# Altium schematic sheet sumboost.SchDoc
size A2
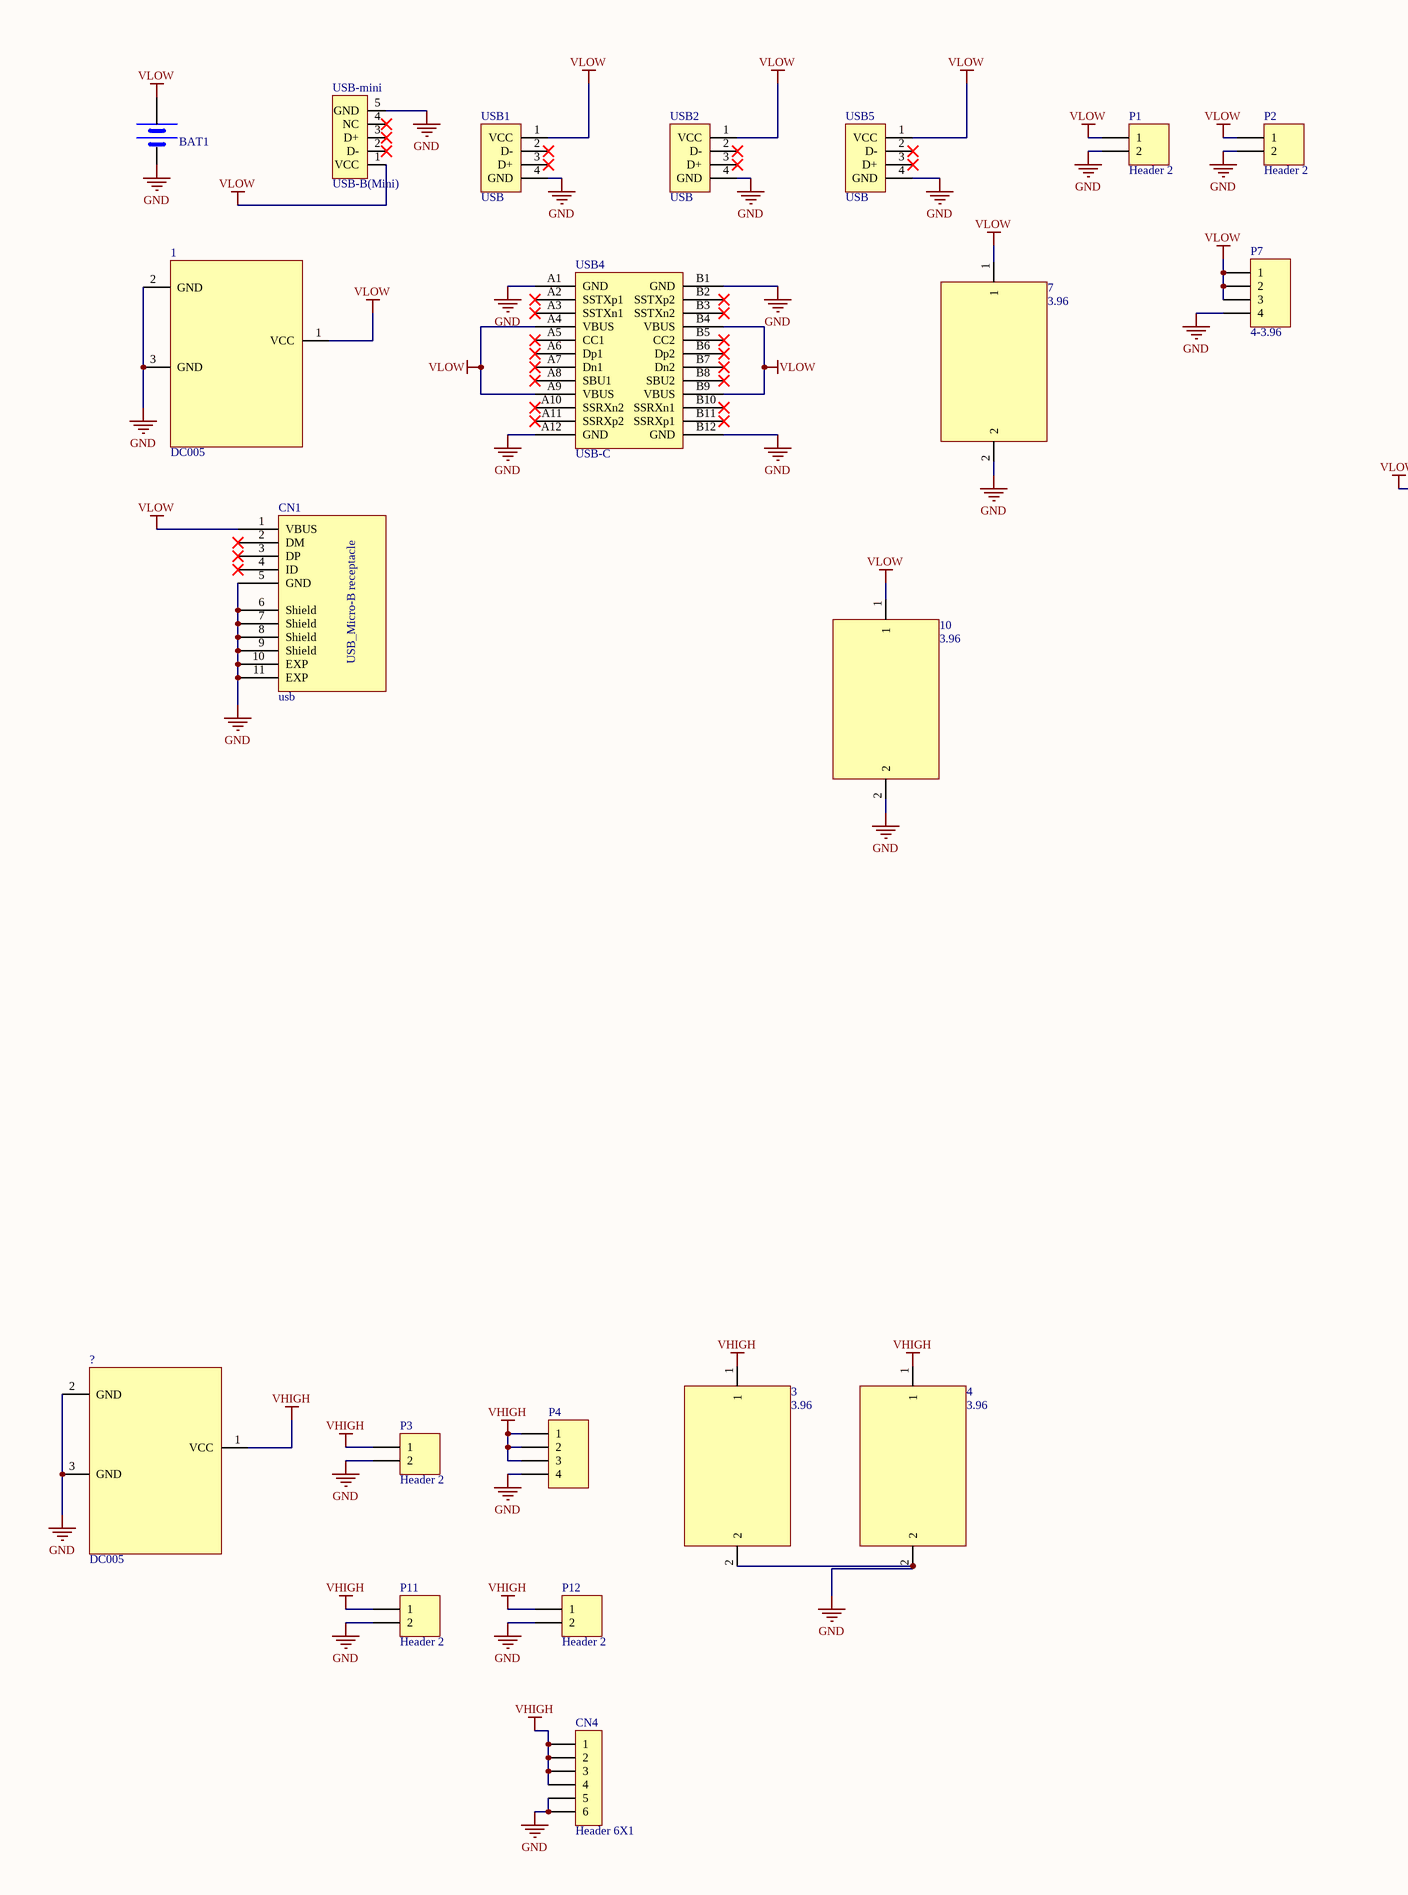
[diagram p0: sumboost.SchDoc, left]
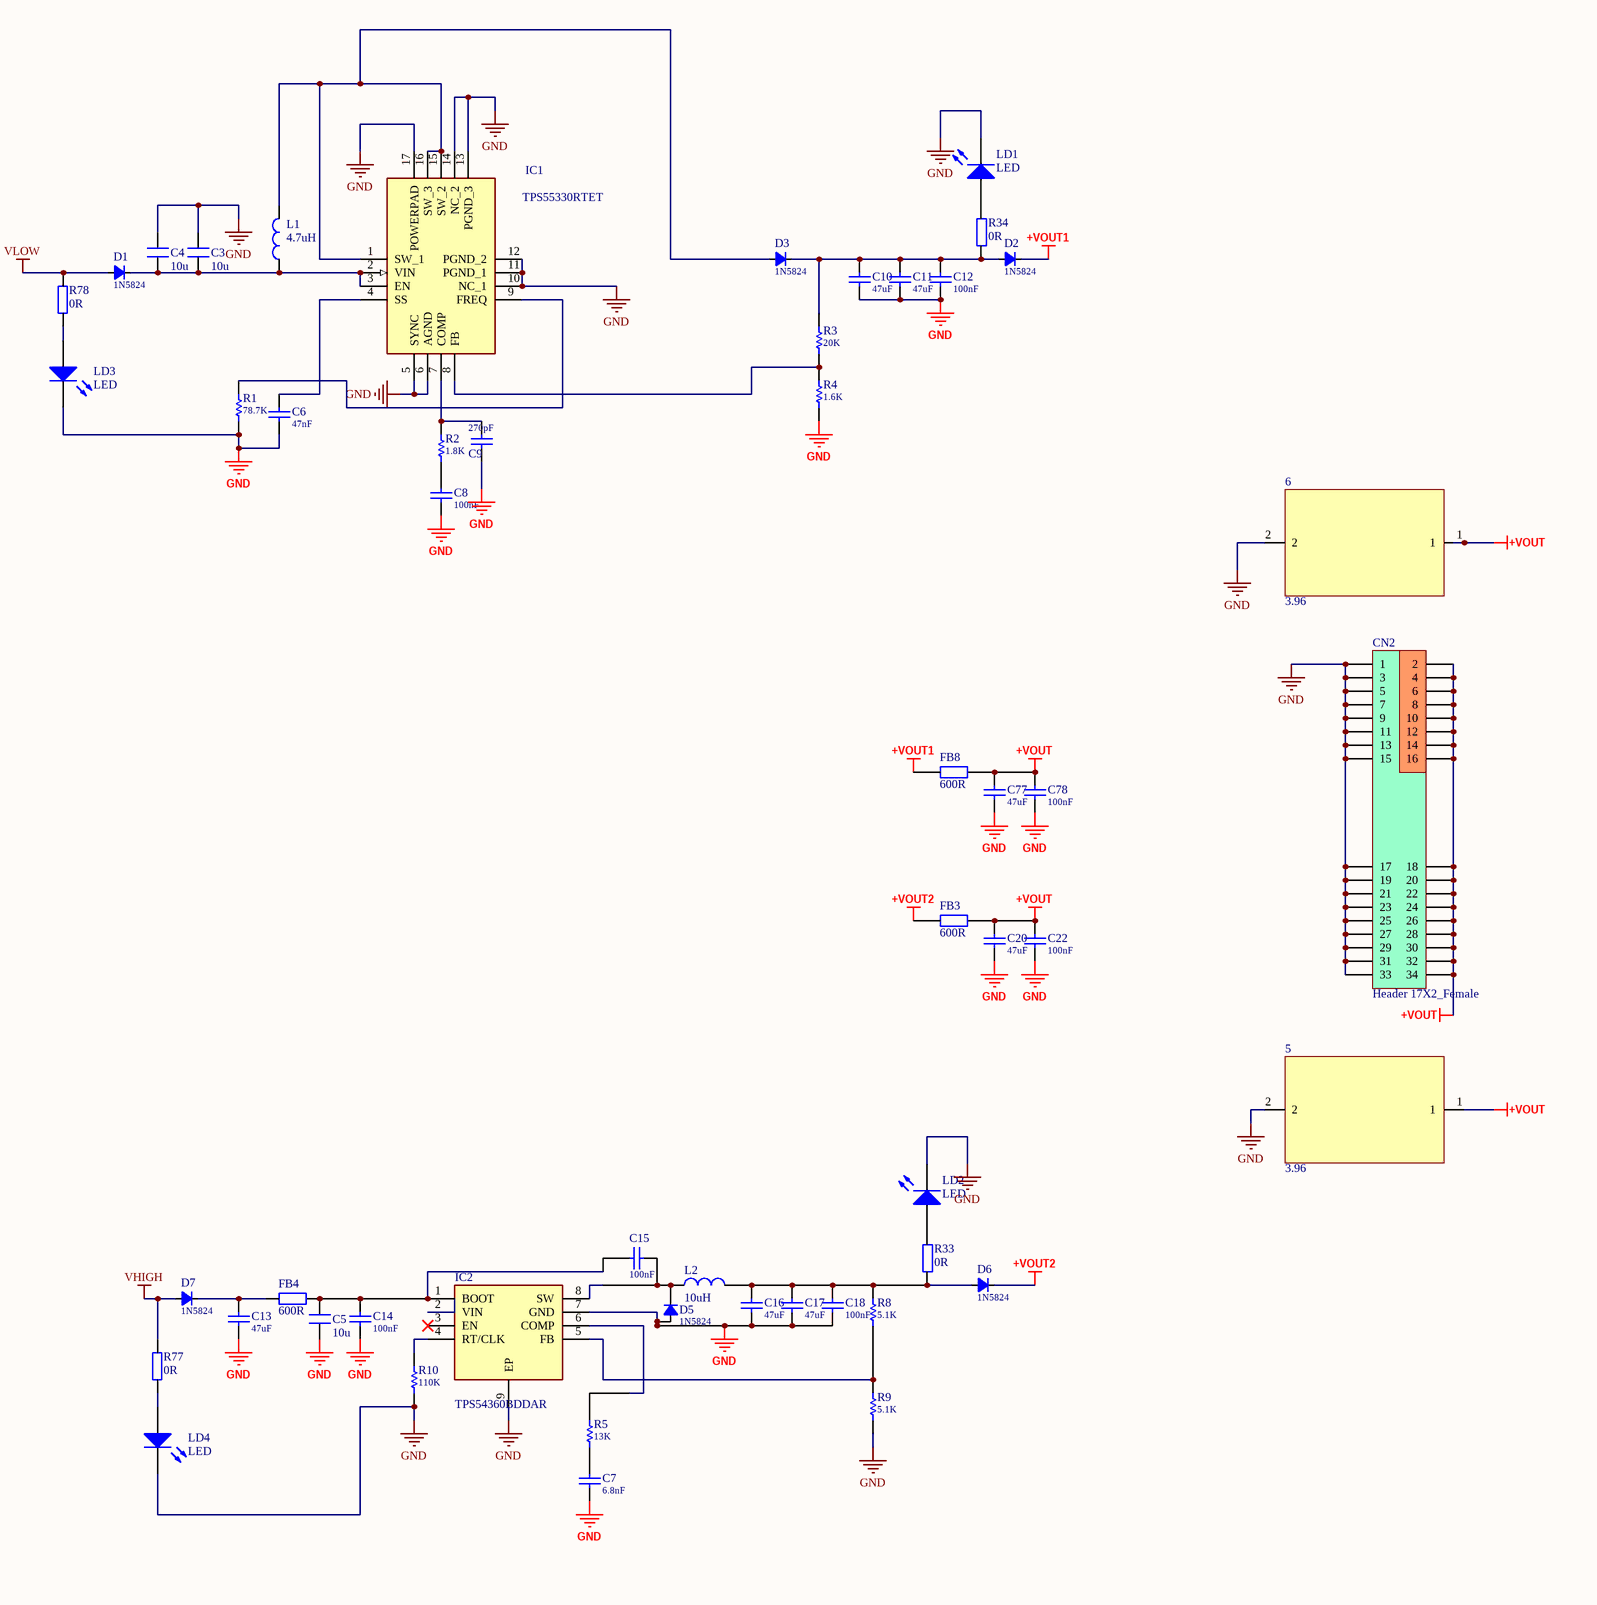
[diagram p1: sumboost.SchDoc, right]

## Parts
1  DC005  [DC10B]
3  3.96  [3.96]
4  3.96  [3.96]
5  3.96  [3.96]
6  3.96  [3.96]
7  3.96  [3.96]
10  3.96  [3.96]
?  DC005  [DC10B]
BAT1  BATT  [BATM]  (value not drawn)
C3  10u  [0603C]
C4  10u  [1206C]
C5  10u  [1206C]
C6  value 47nF  [C0603-L]  (hidden comment: Cap-S)
C7  value 6.8nF  [C0603-L]  (hidden comment: Cap-S)
C8  value 100nF  [C0603-L]  (hidden comment: Cap-S)
C9  value 270pF  [C0603-L]  (hidden comment: Cap-S)
C10  value 47uF  [C1206-L]  (hidden comment: Cap-S)
C11  value 47uF  [C1206-L]  (hidden comment: Cap-S)
C12  value 100nF  [C0603-L]  (hidden comment: Cap-S)
C13  value 47uF  [C1206-L]  (hidden comment: Cap-S)
C14  value 100nF  [C0603-L]  (hidden comment: Cap-S)
C15  value 100nF  [C0603-L]  (hidden comment: Cap-S)
C16  value 47uF  [C1206-L]  (hidden comment: Cap-S)
C17  value 47uF  [C1206-L]  (hidden comment: Cap-S)
C18  value 100nF  [C0603-L]  (hidden comment: Cap-S)
C20  value 47uF  [C1206-L]  (hidden comment: Cap-S)
C22  value 100nF  [C0603-L]  (hidden comment: Cap-S)
C77  value 47uF  [C1206-L]  (hidden comment: Cap-S)
C78  value 100nF  [C0603-L]  (hidden comment: Cap-S)
CN1  usb  [Molex_1050170001]
CN2  Header 17X2_Female  [HDR_17x2_2R54_V_F]
CN4  Header 6X1  [HDR_1x6_2R54_V_M]
D1  Model: 1N5824  [D-SMA]  (hidden comment: D)
D2  Model: 1N5824  [D-SMA]  (hidden comment: D)
D3  Model: 1N5824  [D-SMA]  (hidden comment: D)
D5  Model: 1N5824  [D-SMA]  (hidden comment: D)
D6  Model: 1N5824  [D-SMA]  (hidden comment: D)
D7  Model: 1N5824  [D-SMA]  (hidden comment: D)
FB3  600R  [FB-0805]
FB4  600R  [FB-0805]
FB8  600R  [FB-0805]
IC1  TPS55330RTET  [VQFN-16]
IC2  TPS54360BDDAR  [SOIC127P600X170-9N]
L1  4.7uH  [L-6.5mm]
L2  10uH  [L-6.5mm]
LD1  LED  [SMDLED]
LD2  LED  [SMDLED]
LD3  LED  [SMDLED]
LD4  LED  [SMDLED]
P1  Header 2  [HDR1X2]
P2  Header 2  [HDR1X2]
P3  Header 2  [HDR1X2]
P4  (no value)  [HDR1X4]
P7  4-3.96  [HDR1X4]
P11  Header 2  [HDR1X2]
P12  Header 2  [HDR1X2]
R1  value 78.7K  [R0603-L]  (hidden comment: R)
R2  value 1.8K  [R0603-L]  (hidden comment: R)
R3  value 20K  [R0603-L]  (hidden comment: R)
R4  value 1.6K  [R0603-L]  (hidden comment: R)
R5  value 13K  [R0603-L]  (hidden comment: R)
R8  value 5.1K  [R0603-L]  (hidden comment: R)
R9  value 5.1K  [R0603-L]  (hidden comment: R)
R10  value 110K  [R0603-L]  (hidden comment: R)
R33  0R  [0603R]
R34  0R  [0603R]
R77  0R  [0603R]
R78  0R  [0603R]
USB1  USB  [USB-A/S_B]
USB2  USB  [USB-A/S_B]
USB4  USB-C  [USB-C/S_A]
USB5  USB  [USB-B/S_A]
USB-mini  USB-B(Mini)  [USB/SM0.8-6H5]

## Nets
+VOUT: 5.1 6.1 C20.2 C22.2 C77.2 C78.2 CN2.2 CN2.4 CN2.6 CN2.8 CN2.10 CN2.12 CN2.14 CN2.16 CN2.18 CN2.20 CN2.22 CN2.24 CN2.26 CN2.28 CN2.30 CN2.32 CN2.34 FB3.2 FB8.2
+VOUT1: D2.2(K) FB8.1
+VOUT2: D6.2(K) FB3.1
GND: 1.2(GND) 1.3(GND) 3.2 4.2 5.2 6.2 7.2 10.2 ?.2(GND) ?.3(GND) BAT1.2(GND) C3.2 C4.2 C5.1 C6.1 C7.1 C8.1 C9.1 C10.1 C11.1 C12.1 C13.1 C14.1 C16.1 C17.1 C18.1 C20.1 C22.1 C77.1 C78.1 CN1.5(GND) CN1.6(Shield) CN1.7(Shield) CN1.8(Shield) CN1.9(Shield) CN1.10(EXP) CN1.11(EXP) CN2.1 CN2.3 CN2.5 CN2.7 CN2.9 CN2.11 CN2.13 CN2.15 CN2.17 CN2.19 CN2.21 CN2.23 CN2.25 CN2.27 CN2.29 CN2.31 CN2.33 CN4.5 CN4.6 D5.1(A) IC1.5(SYNC) IC1.6(AGND) IC1.10(NC_1) IC1.11(PGND_1) IC1.12(PGND_2) IC1.13(PGND_3) IC1.14(NC_2) IC1.17(POWERPAD) IC2.7(GND) IC2.9(EP) LD1.2(K) LD2.2(K) LD3.2(K) LD4.2(K) P1.2 P2.2 P3.2 P4.4 P7.4 P11.2 P12.2 R1.2 R4.1 R9.1 R10.1 USB1.4(GND) USB2.4(GND) USB4.A1(GND) USB4.A12(GND) USB4.B1(GND) USB4.B12(GND) USB5.4(GND) USB-mini.5(GND)
VHIGH: 3.1 4.1 ?.1(VCC) CN4.1 CN4.2 CN4.3 CN4.4 D7.1(A) P3.1 P4.1 P4.2 P4.3 P11.1 P12.1 R77.1
VLOW: 1.1(VCC) 7.1 10.1 BAT1.1(VCC) CN1.1(VBUS) D1.1(A) P1.1 P2.1 P7.1 P7.2 P7.3 R78.1 USB1.1(VCC) USB2.1(VCC) USB4.A4(VBUS) USB4.A9(VBUS) USB4.B4(VBUS) USB4.B9(VBUS) USB5.1(VCC) USB-mini.1(VCC)
NetC3_1: C3.1 C4.1 D1.2(K) IC1.2(VIN) IC1.3(EN) L1.1
NetC5_2: C5.2 C14.2 C15.1 FB4.2 IC2.1(BOOT) IC2.2(VIN)
NetC6_2: C6.2 IC1.4(SS)
NetC7_2: C7.2 R5.1
NetC8_2: C8.2 R2.2
NetC9_2: C9.2 IC1.7(COMP) R2.1
NetC10_2: C10.2 C11.2 C12.2 D2.1(A) D3.2(K) R3.2 R34.1
NetC13_2: C13.2 D7.2(K) FB4.1
NetC15_2: C15.2 D5.2(K) IC2.8(SW) L2.1
NetC16_2: C16.2 C17.2 C18.2 D6.1(A) L2.2 R8.2 R33.1
NetD3_1: D3.1(A) IC1.1(SW_1) IC1.15(SW_2) IC1.16(SW_3) L1.2
NetIC1_8: IC1.8(FB) R3.1 R4.2
NetIC1_9: IC1.9(FREQ) R1.1
NetIC2_4: IC2.4(RT/CLK) R10.2
NetIC2_5: IC2.5(FB) R8.1 R9.2
NetIC2_6: IC2.6(COMP) R5.2
NetLD1_1: LD1.1(A) R34.2
NetLD2_1: LD2.1(A) R33.2
NetLD3_1: LD3.1(A) R78.2
NetLD4_1: LD4.1(A) R77.2

Not connected (* = marked no-connect by the designer): CN1 2(DM)* 3(DP)* 4(ID)*; IC2 3(EN)*; USB1 2(D-)* 3(D+)*; USB2 2(D-)* 3(D+)*; USB4 A2(SSTXp1)* A3(SSTXn1)* A5(CC1)* A6(Dp1)* A7(Dn1)* A8(SBU1)* A10(SSRXn2)* A11(SSRXp2)* B2(SSTXp2)* B3(SSTXn2)* B5(CC2)* B6(Dp2)* B7(Dn2)* B8(SBU2)* B10(SSRXn1)* B11(SSRXp1)*; USB5 2(D-)* 3(D+)*; USB-mini 2(D-)* 3(D+)* 4(NC)*

## Notes on the sheet
- (in symbol usb) USB_Micro-B receptacle

## Library data of the parts
BAT1 = BAT
C3-C5 = C: Capacitor
C6-C18 C20 C22 C77 C78 = Cap-S: 贴片瓷片电容
CN2 = Header 17X2_Female: Header, 17-Pin, Dual row,female; Revision: 17-Jul-2002: Re-released for DXP Platform.; Publisher: Altium Limited
CN4 = Header 6X1: Header, 6-Pin, Single row; LatestRevisionDate: 17-Jul-2002; LatestRevisionNote: Re-released for DXP Platform.; Publisher: Altium Limited
D1-D3 D5-D7 = Diode: 二极管
FB3 FB4 FB8 = FB
IC1 = TPS55330RTET: Integrated Circuit; Manufacturer_Name: Texas Instruments; Datasheet Link: http://docs-emea.rs-online.com/webdocs/1323/0900766b8132341b.pdf; Height: 0.8mm; Manufacturer_Part_Number: TPS55330RTET; Mouser Part Number: 595-TPS55330RTET; Mouser Price/Stock: https://www.mouser.co.uk/ProductDetail/Texas-Instruments/TPS55330RTET/?qs=G%2FfA1zOA0fJsAvkaZR6vXQ%3D%3D; Arrow Part Number: TPS55330RTET; Arrow Price/Stock: https://www.arrow.com/en/products/tps55330rtet/texas-instruments
IC2 = TPS54360BDDAR: Integrated Circuit; Manufacturer_Name: Texas Instruments; Datasheet Link: http://www.ti.com/lit/gpn/TPS54360B; Height: 1.7mm; Manufacturer_Part_Number: TPS54360BDDAR; Mouser Part Number: 595-TPS54360BDDAR; Mouser Price/Stock: https://www.mouser.co.uk/ProductDetail/Texas-Instruments/TPS54360BDDAR?qs=l7cgNqFNU1iKlQpZ394odQ%3D%3D; Arrow Part Number: TPS54360BDDAR; Arrow Price/Stock: https://www.arrow.com/en/products/tps54360bddar/texas-instruments
L1 L2 = Inductor
LD1-LD4 = LED: Typical RED, GREEN, YELLOW, AMBER GaAs LED; Published: 8-Jun-2000; LatestRevisionDate: 17-Jul-2002; LatestRevisionNote: Re-released for DXP Platform.; PackageDocument: Feb-2002; PackageReference: 3.2X1.6X1.1; Publisher: Altium Limited
P1-P3 P11 P12 = Header 2: Header, 2-Pin; LatestRevisionDate: 17-Jul-2002; LatestRevisionNote: Re-released for DXP Platform.; Publisher: Altium Limited
P4 P7 = Header 4: Header, 4-Pin; LatestRevisionDate: 17-Jul-2002; LatestRevisionNote: Re-released for DXP Platform.; Publisher: Altium Limited
R1-R5 R8-R10 = Res: 贴片电阻
R33 R34 R77 R78 = Resistor
USB1 USB2 = USB-A/S: USB-A型母接口; 版权归属: 源创客; BOM名称: USB-A型母接口; 学习资源: www.ooocke.com
USB4 = USB-C/S: USB-C型母接口; 版权归属: 源创客; BOM名称: USB-C型母接口; 学习资源: www.ooocke.com
USB5 = USB-B/S: USB-B型母接口; 版权归属: 源创客; BOM名称: USB-B型母接口; 学习资源: www.ooocke.com
USB-mini = USB5
CN1 = usb: Silkscreen: USB